# EAGLE design GIfBoardV3 (EAGLE 7.2.0)
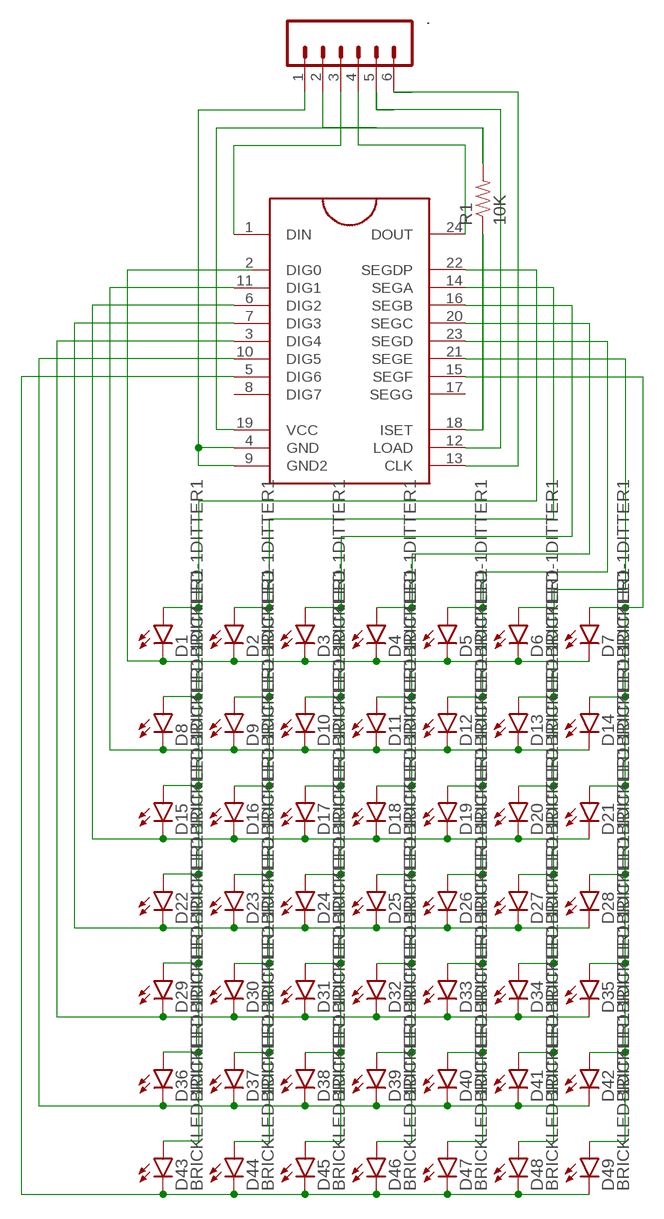
[diagram p0: schematic, sheet 1]

## Parts
.  M06NO_SILK_FEMALE_PTH  [1X06_NO_SILK]
D1  BRICKLED-1DITTER1  [BRICKLED-1DITTER]
D2  BRICKLED-1DITTER1  [BRICKLED-1DITTER]
D3  BRICKLED-1DITTER1  [BRICKLED-1DITTER]
D4  BRICKLED-1DITTER1  [BRICKLED-1DITTER]
D5  BRICKLED-1DITTER1  [BRICKLED-1DITTER]
D6  BRICKLED-1DITTER1  [BRICKLED-1DITTER]
D7  BRICKLED-1DITTER1  [BRICKLED-1DITTER]
D8  BRICKLED-1DITTER1  [BRICKLED-1DITTER]
D9  BRICKLED-1DITTER1  [BRICKLED-1DITTER]
D10  BRICKLED-1DITTER1  [BRICKLED-1DITTER]
D11  BRICKLED-1DITTER1  [BRICKLED-1DITTER]
D12  BRICKLED-1DITTER1  [BRICKLED-1DITTER]
D13  BRICKLED-1DITTER1  [BRICKLED-1DITTER]
D14  BRICKLED-1DITTER1  [BRICKLED-1DITTER]
D15  BRICKLED-1DITTER1  [BRICKLED-1DITTER]
D16  BRICKLED-1DITTER1  [BRICKLED-1DITTER]
D17  BRICKLED-1DITTER1  [BRICKLED-1DITTER]
D18  BRICKLED-1DITTER1  [BRICKLED-1DITTER]
D19  BRICKLED-1DITTER1  [BRICKLED-1DITTER]
D20  BRICKLED-1DITTER1  [BRICKLED-1DITTER]
D21  BRICKLED-1DITTER1  [BRICKLED-1DITTER]
D22  BRICKLED-1DITTER1  [BRICKLED-1DITTER]
D23  BRICKLED-1DITTER1  [BRICKLED-1DITTER]
D24  BRICKLED-1DITTER1  [BRICKLED-1DITTER]
D25  BRICKLED-1DITTER1  [BRICKLED-1DITTER]
D26  BRICKLED-1DITTER1  [BRICKLED-1DITTER]
D27  BRICKLED-1DITTER1  [BRICKLED-1DITTER]
D28  BRICKLED-1DITTER1  [BRICKLED-1DITTER]
D29  BRICKLED-1DITTER1  [BRICKLED-1DITTER]
D30  BRICKLED-1DITTER1  [BRICKLED-1DITTER]
D31  BRICKLED-1DITTER1  [BRICKLED-1DITTER]
D32  BRICKLED-1DITTER1  [BRICKLED-1DITTER]
D33  BRICKLED-1DITTER1  [BRICKLED-1DITTER]
D34  BRICKLED-1DITTER1  [BRICKLED-1DITTER]
D35  BRICKLED-1DITTER1  [BRICKLED-1DITTER]
D36  BRICKLED-1DITTER1  [BRICKLED-1DITTER]
D37  BRICKLED-1DITTER1  [BRICKLED-1DITTER]
D38  BRICKLED-1DITTER1  [BRICKLED-1DITTER]
D39  BRICKLED-1DITTER1  [BRICKLED-1DITTER]
D40  BRICKLED-1DITTER1  [BRICKLED-1DITTER]
D41  BRICKLED-1DITTER1  [BRICKLED-1DITTER]
D42  BRICKLED-1DITTER1  [BRICKLED-1DITTER]
D43  BRICKLED-1DITTER1  [BRICKLED-1DITTER]
D44  BRICKLED-1DITTER1  [BRICKLED-1DITTER]
D45  BRICKLED-1DITTER1  [BRICKLED-1DITTER]
D46  BRICKLED-1DITTER1  [BRICKLED-1DITTER]
D47  BRICKLED-1DITTER1  [BRICKLED-1DITTER]
D48  BRICKLED-1DITTER1  [BRICKLED-1DITTER]
D49  BRICKLED-1DITTER1  [BRICKLED-1DITTER]
MAX7219  MAX7219DIP  [DIL24]
R1  10K  1KOHM-1/4W-5%(PTH)  [AXIAL-0.3]

## Nets
N$1: ..4 MAX7219.24(DOUT)
N$2: ..5 MAX7219.12(LOAD)
N$3: ..3 MAX7219.1(DIN)
N$5: ..1 MAX7219.4(GND) MAX7219.9(GND2)
N$6: D8.K(C) D9.K(C) D10.K(C) D11.K(C) D12.K(C) D13.K(C) D14.K(C) MAX7219.11(DIG1)
N$7: ..2 MAX7219.19(VCC) R1.P$2
N$8: ..6 MAX7219.13(CLK)
N$9: D1.A D8.A D15.A D22.A D29.A D36.A D43.A MAX7219.22(SEGDP)
N$10: D1.K(C) D2.K(C) D3.K(C) D4.K(C) D5.K(C) D6.K(C) D7.K(C)
N$11: D15.K(C) D16.K(C) D17.K(C) D18.K(C) D19.K(C) D20.K(C) D21.K(C) MAX7219.6(DIG2)
N$12: D2.A D9.A D16.A D23.A D30.A D37.A D44.A MAX7219.14(SEGA)
N$13: D29.K(C) D30.K(C) D31.K(C) D32.K(C) D33.K(C) D34.K(C) D35.K(C) MAX7219.3(DIG4)
N$14: D36.K(C) D37.K(C) D38.K(C) D39.K(C) D40.K(C) D41.K(C) D42.K(C) MAX7219.10(DIG5)
N$15: D43.K(C) D44.K(C) D45.K(C) D46.K(C) D47.K(C) D48.K(C) D49.K(C) MAX7219.5(DIG6)
N$16: MAX7219.18(ISET) R1.P$1
N$18: D3.A D10.A D17.A D24.A D31.A D38.A D45.A MAX7219.16(SEGB)
N$19: D5.A D12.A D19.A D26.A D33.A D40.A D47.A MAX7219.23(SEGD)
N$20: D4.A D11.A D18.A D25.A D32.A D39.A D46.A MAX7219.20(SEGC)
N$22: D6.A D13.A D20.A D27.A D34.A D41.A D48.A MAX7219.21(SEGE)
N$23: D7.A D14.A D21.A D28.A D35.A D42.A D49.A MAX7219.15(SEGF)
N$32: D22.K(C) D23.K(C) D24.K(C) D25.K(C) D26.K(C) D27.K(C) D28.K(C) MAX7219.7(DIG3)
Unconnected: MAX7219.2(DIG0) MAX7219.8(DIG7) MAX7219.17(SEGG)

## Library data of the parts
. = SparkFun-Connectors:M06: Header 6 Standard 6-pin 0.1" header. Use with straight break away headers (SKU : PRT-00116), right angle break away headers (PRT-00553), swiss pins (PRT-00743), machine pins (PRT-00117), and female headers (PRT-00115). Molex polarized connector foot print use with SKU : PRT-08094 with associated crimp pins and housings. NOTES ON THE VARIANTS LOCK and LOCK_LONGPADS... This footprint was designed to help hold the alignment of a through-hole component (i.e. 6-pin header) while soldering it into place. You may notice that each hole has been shifted either up or down by 0.005 of an inch from it's more standard position (which is a perfectly straight line). This slight alteration caused the pins (the squares in the middle) to touch the edges of the holes. Because they are alternating, it causes a "brace" to hold the component in place. 0.005 has proven to be the perfect amount of "off-center" position when using our standard breakaway headers. Although looks a little odd when you look at the bare footprint, once you have a header in there, the alteration is very hard to notice. Also,if you push a header all the way into place, it is covered up entirely on the bottom side. This idea of altering the position of holes to aid alignment will be further integrated into the Sparkfun Library for other footprints. It can help hold any component with 3 or more connection pins.; PROD_ID: CONN-08437
D1-D49 = BrickLED:BRICKLED-1DITTER: One ditter, LEGO compatible LED
MAX7219 = SparkFun-DigitalIC:MAX7219: 8-digit, 8-segment LED display driver, serial input
R1 = SparkFun-Resistors:1KOHM-1/4W-5%(PTH): RES-08380; PROD_ID: RES-08380; VALE: 1k

## Board
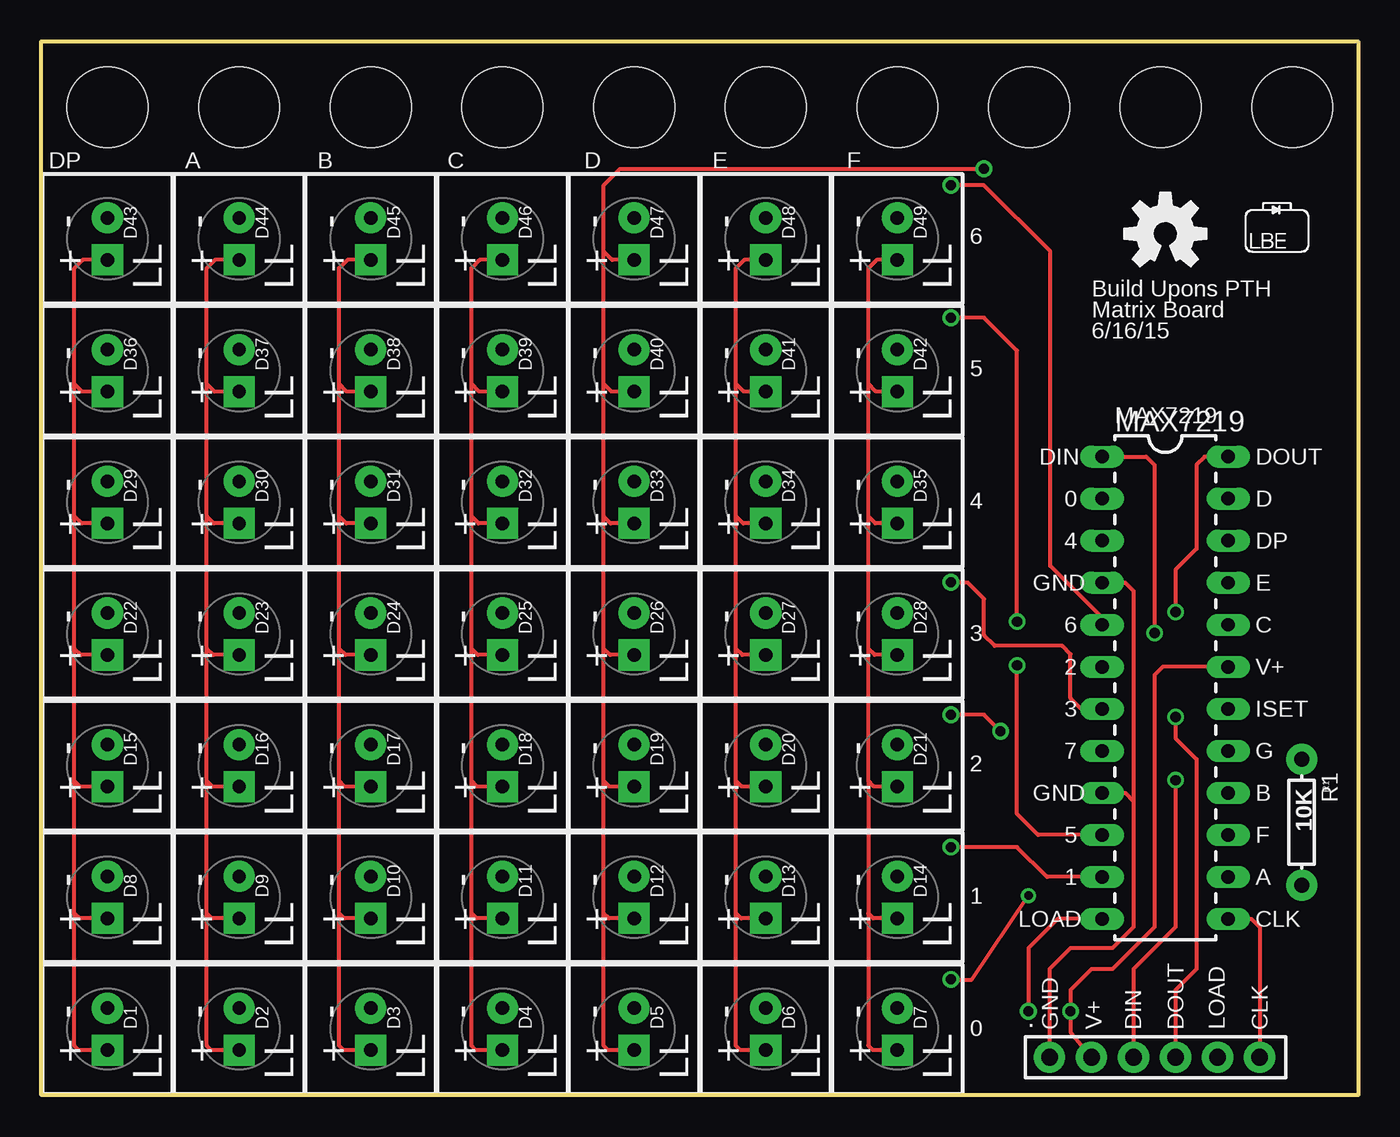
[diagram p1: board, top side]
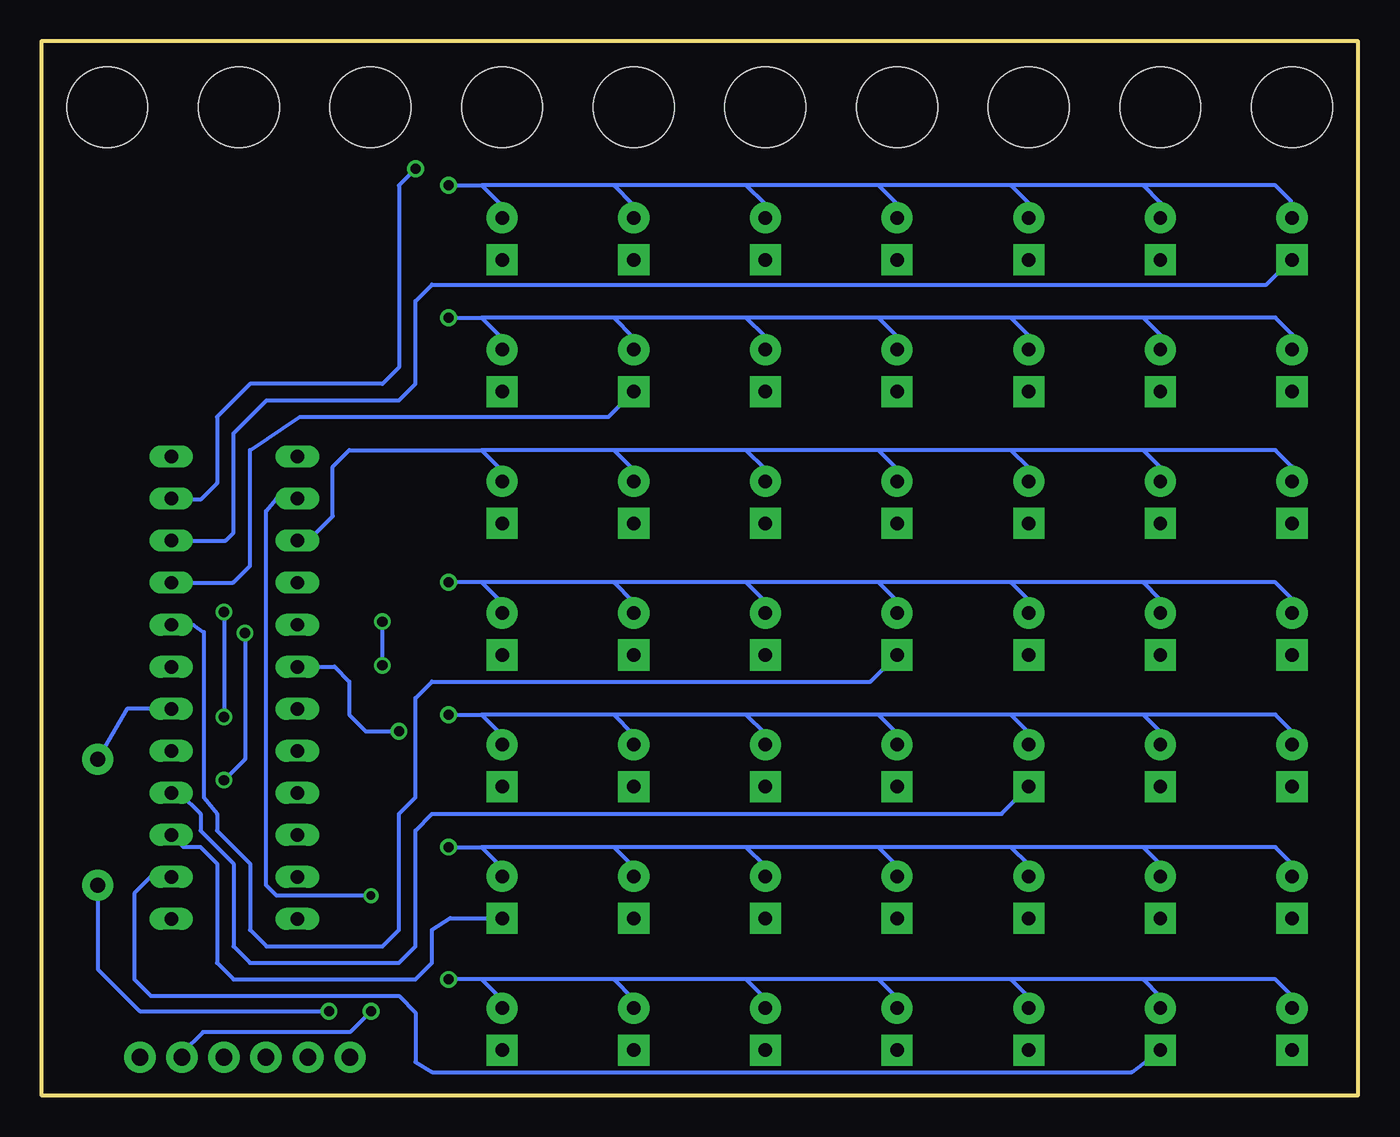
[diagram p2: board, bottom side, seen from below]

Size 79.62 x 63.7 mm. Coordinates in mm from the lower left corner, seen from the top.
Outline: 0,0 0,63.7 79.62,63.7 79.62,0 0,0
Copper layers (1*16): Top 0.035mm / dielectric 1.5mm / Bottom 0.035mm
Design rules "default": minimum track width 10mil, minimum drill 24mil, track to track 8mil, track to pad 8mil, pad to pad 8mil, via to via 8mil, smd to smd 8mil, copper to edge 40mil, drill to drill 8mil, minimum pad ring 10mil, minimum via ring 8mil, stop-mask expansion 4mil, vias tented up to drill 0mil, thermal gap 10mil
Holes 4.88 mm at 4,59.72 11.96,59.72 19.92,59.72 27.88,59.72 35.84,59.72 43.8,59.72 51.76,59.72 59.72,59.72 67.68,59.72 75.64,59.72

### Footprints (pad centres in the part's own frame; a part is rotated, then mirrored left to right if it is on the bottom)
1X06_NO_SILK = drill 1.016 pad 1.88: 1 0,0; 2 2.54,0; 3 5.08,0; 4 7.62,0; 5 10.16,0; 6 12.7,0
BRICKLED-1DITTER = drill 0.813 pad 1.88 square: A -1.27,0 | drill 0.813 pad 1.88: K 1.27,0
DIL24 = drill 0.813 long: 1 -13.97,-3.81; 2 -11.43,-3.81; 3 -8.89,-3.81; 4 -6.35,-3.81; 5 -3.81,-3.81; 6 -1.27,-3.81; 7 1.27,-3.81; 8 3.81,-3.81; 9 6.35,-3.81; 10 8.89,-3.81; 11 11.43,-3.81; 12 13.97,-3.81; 13 13.97,3.81; 14 11.43,3.81; 15 8.89,3.81; 16 6.35,3.81; 17 3.81,3.81; 18 1.27,3.81; 19 -1.27,3.81; 20 -3.81,3.81; 21 -6.35,3.81; 22 -8.89,3.81; 23 -11.43,3.81; 24 -13.97,3.81
AXIAL-0.3 = drill 0.9 pad 1.88: P$1 -3.81,0; P$2 3.81,0

### Placement (x,y rotation side)
.  60.96,2.3 0 top
D1  4,4 90 top
D2  11.96,4 90 top
D3  19.92,4 90 top
D4  27.88,4 90 top
D5  35.84,4 90 top
D6  43.8,4 90 top
D7  51.76,4 90 top
D8  4,11.96 90 top
D9  11.96,11.96 90 top
D10  19.92,11.96 90 top
D11  27.88,11.96 90 top
D12  35.84,11.96 90 top
D13  43.8,11.96 90 top
D14  51.76,11.96 90 top
D15  4,19.92 90 top
D16  11.96,19.92 90 top
D17  19.92,19.92 90 top
D18  27.88,19.92 90 top
D19  35.84,19.92 90 top
D20  43.8,19.92 90 top
D21  51.76,19.92 90 top
D22  4,27.88 90 top
D23  11.96,27.88 90 top
D24  19.92,27.88 90 top
D25  27.88,27.88 90 top
D26  35.84,27.88 90 top
D27  43.8,27.88 90 top
D28  51.76,27.88 90 top
D29  4,35.84 90 top
D30  11.96,35.84 90 top
D31  19.92,35.84 90 top
D32  27.88,35.84 90 top
D33  35.84,35.84 90 top
D34  43.8,35.84 90 top
D35  51.76,35.84 90 top
D36  4,43.8 90 top
D37  11.96,43.8 90 top
D38  19.92,43.8 90 top
D39  27.88,43.8 90 top
D40  35.84,43.8 90 top
D41  43.8,43.8 90 top
D42  51.76,43.8 90 top
D43  4,51.76 90 top
D44  11.96,51.76 90 top
D45  19.92,51.76 90 top
D46  27.88,51.76 90 top
D47  35.84,51.76 90 top
D48  43.8,51.76 90 top
D49  51.76,51.76 90 top
MAX7219  67.96,24.63 270 top
R1  76.2,16.51 270 top
U$2  [OSHW-LOGO-M]  67.96,52.07 0 top
U$3  [LUNCHBOXELECTRONICS]  72.77,50.8 0 top

### Tracks (layer width: path | path; a pad name or v marks a point on that pad's centre or on a via)
N$1  (via drill 0.61)
  Top 0.254: MAX7219.24 70.35,38.6 69.85,38.1 69.85,33.02 68.58,31.75 v68.58,29.21 | v68.58,22.86 68.58,21.59 69.85,20.32 69.85,7.62 68.58,6.35 ..4
  Bottom 0.254: v68.58,29.21 v68.58,22.86
N$2  (via drill 0.61)
  Top 0.254: MAX7219.12 61.46,10.66 59.69,8.89 v59.69,5.08
  Bottom 0.254: v59.69,5.08 60.96,3.81 69.85,3.81 71.12,2.54 ..5
N$3  (via drill 0.61)
  Top 0.254: MAX7219.1 66.81,38.6 67.31,38.1 v67.31,27.94 | v68.58,19.05 68.58,10.16 66.04,7.62 ..3
  Bottom 0.254: v67.31,27.94 67.31,20.32 v68.58,19.05
N$4  (via drill 0.51)
  Top 0.254: 54.99,6.99 56.26,6.99 v59.69,12.06
N$5
  Top 0.254: MAX7219.4 65.54,30.98 66.04,30.48 66.04,17.78 | 66.04,17.78 66.04,10.16 64.77,8.89 62.23,8.89 60.96,7.62 ..1 | MAX7219.9 65.54,18.28 66.04,17.78
N$6  (via drill 0.61)
  Top 0.254: MAX7219.11 60.8,13.2 59,15 v55,15
  Bottom 0.254: D8.K 4,14 5,15 13,15 | 13,15 21,15 | 21,15 29,15 | 29,15 37,15 | 37,15 45,15 | 45,15 53,15 | D9.K 11.96,13.96 13,15 | D10.K 19.92,13.92 21,15 | D11.K 27.88,13.88 29,15 | D12.K 35.84,13.84 37,15 | D13.K 43.8,13.8 45,15 | D14.K 51.76,13.76 53,15 | v55,15 53,15
N$7  (via drill 0.61)
  Top 0.254: MAX7219.19 67.81,25.9 67.31,25.4 67.31,10.16 64.77,7.62 63.5,7.62 62.23,6.35 v62.23,5.08 62.23,3.81 ..2
  Bottom 0.254: R1.P$2 76.2,7.62 73.66,5.08 v62.23,5.08
N$8
  Top 0.254: MAX7219.13 73.16,10.66 73.66,10.16 ..6
N$9
  Top 0.254: D1.A 2.27,2.73 2,3 2,11 | 2,11 2,19 | 2,19 2,27 | 2,27 2,35 | 2,35 2,43 | 2,43 2,50 2.51,50.49 D43.A | D8.A 2.31,10.69 2,11 | D15.A 2.35,18.65 2,19 | D22.A 2.39,26.61 2,27 | D29.A 2.43,34.57 2,35 | D36.A 2.47,42.53 2,43
  Bottom 0.254: MAX7219.22 68.48,33.52 68,34 68,40 66,42 58,42 57,43 57,48 56,49 5.55,49 D43.A
N$10  (via drill 0.61)
  Bottom 0.254: D1.K 4,6 5,7 13,7 | 13,7 21,7 | 21,7 29,7 | 29,7 37,7 | 37,7 45,7 | 45,7 53,7 | 53,7 v55,7 | D2.K 11.96,5.96 13,7 | D3.K 19.92,5.92 21,7 | D4.K 27.88,5.88 29,7 | D5.K 35.84,5.84 37,7 | D6.K 43.8,5.8 45,7 | D7.K 51.76,5.76 53,7
N$11  (via drill 0.61)
  Top 0.254: v58,22 57,23 v55,23
  Bottom 0.254: D15.K 4,22 5,23 13,23 | 13,23 21,23 | 21,23 29,23 | 29,23 37,23 | 37,23 45,23 | 45,23 53,23 | D16.K 11.96,21.96 13,23 | D17.K 19.92,21.92 21,23 | D18.K 27.88,21.88 29,23 | D19.K 35.84,21.84 37,23 | D20.K 43.8,21.8 45,23 | D21.K 51.76,21.76 53,23 | MAX7219.6 62.9,25.9 61.9,25.9 61,25 61,23 60,22 v58,22 | v55,23 53,23
N$12
  Top 0.254: D2.A 10.27,2.73 10,3 10,11 | 10,11 10,19 | 10,19 10,27 | 10,27 10,35 | 10,35 10,43 | 10,43 10,50 10.51,50.49 D44.A | D37.A 10.47,42.53 10,43 | D30.A 10.43,34.57 10,35 | D23.A 10.39,26.61 10,27 | D16.A 10.35,18.65 10,19 | D9.A 10.31,10.69 10,11
  Bottom 0.254: MAX7219.14 73,13.2 74,12.2 74,7 73,6 58,6 57,5 57,2 56,1.4 13.69,1.4 D2.A
N$13
  Bottom 0.254: D29.K 4,38 5,39 13,39 | 13,39 21,39 | 21,39 29,39 | 29,39 37,39 | 37,39 45,39 | 45,39 53,39 | D30.K 11.96,37.96 13,39 | D31.K 19.92,37.92 21,39 | D32.K 27.88,37.88 29,39 | D33.K 35.84,37.84 37,39 | D34.K 43.8,37.8 45,39 | D35.K 51.76,37.76 53,39 | MAX7219.3 63.48,33.52 62,35 62,38 61,39 53,39
N$14  (via drill 0.61)
  Top 0.254: MAX7219.10 60.26,15.74 59,17 v59,25.98 | v59,28.63 59,45 57,47 v55,47
  Bottom 0.254: D36.K 4,46 5,47 13,47 | 13,47 21,47 | 21,47 29,47 | 29,47 37,47 | 37,47 45,47 | 45,47 53,47 | D37.K 11.96,45.96 13,47 | D38.K 19.92,45.92 21,47 | D39.K 27.88,45.88 29,47 | D40.K 35.84,45.84 37,47 | D41.K 43.8,45.8 45,47 | D42.K 51.76,45.76 53,47 | v59,25.98 v59,28.63 | v55,47 53,47
N$15  (via drill 0.61)
  Top 0.254: MAX7219.5 64.15,28.85 61,32 61,51 57,55 v55,55
  Bottom 0.254: D43.K 4.06,54.06 5,55 13,55 | 13,55 21,55 | 21,55 29,55 | 29,55 37,55 | 37,55 45,55 | 45,55 53,55 | D44.K 11.96,53.96 13,55 | D45.K 19.92,53.92 21,55 | D46.K 27.88,53.88 29,55 | D47.K 35.84,53.84 37,55 | D48.K 43.8,53.8 45,55 | D49.K 51.76,53.76 53,55 | v55,55 53,55
N$16
  Bottom 0.254: MAX7219.18 74.43,23.36 R1.P$1
N$18
  Top 0.254: D3.A 18.27,2.73 18,3 18,11 | 18,11 18,19 | 18,19 18,27 | 18,27 18,35 | 18,35 18,43 | 18,43 18,50 18.51,50.49 D45.A | D38.A 18.47,42.53 18,43 | D31.A 18.43,34.57 18,35 | D24.A 18.39,26.61 18,27 | D17.A 18.35,18.65 18,19 | D10.A 18.31,10.69 18,11
  Bottom 0.254: MAX7219.16 71.28,18.28 70,17 70,16 68,14 68,9 67,8 58,8 57,9 57,16 56,17 21.57,17 D17.A
N$19  (via drill 0.61)
  Top 0.254: D5.A 34.27,2.73 34,3 34,11 | 34,11 34,19 | 34,19 34,27 | 34,27 34,35 | 34,35 34,43 | 34,43 34,51 | D12.A 34.31,10.69 34,11 | D19.A 34.35,18.65 34,19 | D26.A 34.39,26.61 34,27 | D33.A 34.43,34.57 34,35 | D40.A 34.47,42.53 34,43 | D47.A 34.51,50.49 34,51 | 34,51 34,55 35,56 v57,56
  Bottom 0.254: v57,56 58,55 58,44 59,43 67,43 69,41 69,37 70,36 71.71,36 MAX7219.23
N$20
  Top 0.254: D4.A 26.27,2.73 26,3 26,11 | 26,11 26,19 | 26,19 26,27 | 26,27 26,35 | 26,35 26,43 | 26,43 26,50 26.51,50.49 D46.A | D11.A 26.31,10.69 26,11 | D18.A 26.35,18.65 26,19 | D25.A 26.39,26.61 26,27 | D32.A 26.43,34.57 26,35 | D39.A 26.47,42.53 26,43
  Bottom 0.254: MAX7219.20 70.44,28.44 69.8,28 69.8,18 69,17 69,16 67,14 67,10 66,9 59,9 58,10 58,17 57,18 57,24 56,25 29.49,25 D25.A
N$22
  Top 0.254: D6.A 42.27,2.73 42,3 42,11 | 42,11 42,19 | 42,19 42,27 | 42,27 42,35 | 42,35 42,43 | 42,43 42,50 42.51,50.49 D48.A | D13.A 42.31,10.69 42,11 | D20.A 42.35,18.65 42,19 | D27.A 42.39,26.61 42,27 | D34.A 42.43,34.57 42,35 | D41.A 42.47,42.53 42,43
  Bottom 0.254: MAX7219.21 68.02,30.98 67,32 67,39 64,41 45.33,41 D41.A
N$23
  Top 0.254: D7.A 50.27,2.73 50,3 50,11 | 50,19 50,27 | 50,27 50,35 | 50,35 50,43 | 50,43 50,50 50.51,50.49 D49.A | D28.A 50.39,26.61 50,27 | D35.A 50.43,34.57 50,35 | D42.A 50.47,42.53 50,43 | D14.A 50.31,10.69 50,11 | D21.A 50.35,18.65 50,19 | 50,19 50,11
  Bottom 0.254: D14.A 54.9,10.7 56,10 56,8 57,7 68,7 69,8 69,14 70,15 71.03,15 MAX7219.15
N$24
  Bottom 0.254: 59.69,12.06 65.41,12.06 66.04,12.7 66.04,35.31 65.41,36.07 64.14,36.07
N$32  (via drill 0.61)
  Top 0.254: v55,31 56,31 57,30 57,27.81 57.64,27.17 61.73,27.17 62.23,26.67 62.23,24 62.87,23.37 MAX7219.7
  Bottom 0.254: D22.K 4,30 5,31 13,31 | 13,31 21,31 | 21,31 29,31 | 29,31 37,31 | 37,31 45,31 | 45,31 53,31 | 53,31 v55,31 | D23.K 11.96,29.96 13,31 | D24.K 19.92,29.92 21,31 | D25.K 27.88,29.88 29,31 | D26.K 35.84,29.84 37,31 | D27.K 43.8,29.8 45,31 | D28.K 51.76,29.76 53,31

### Text on the board
tPlace: DP | A | B | C | D | E | F | 6 | Build Upons PTH | Matrix Board | 6/16/15 | 5 | MAX7219 | DIN | DOUT | 0 | D | 4 | 4 | DP | GND | E | 6 | C | 3 | 2 | V+ | 3 | ISET | 2 | 7 | G | GND | B | R1 | 5 | F | 1 | A | 1 | LOAD | CLK | 0 | GND | V+ | DIN | DOUT | LOAD | CLK